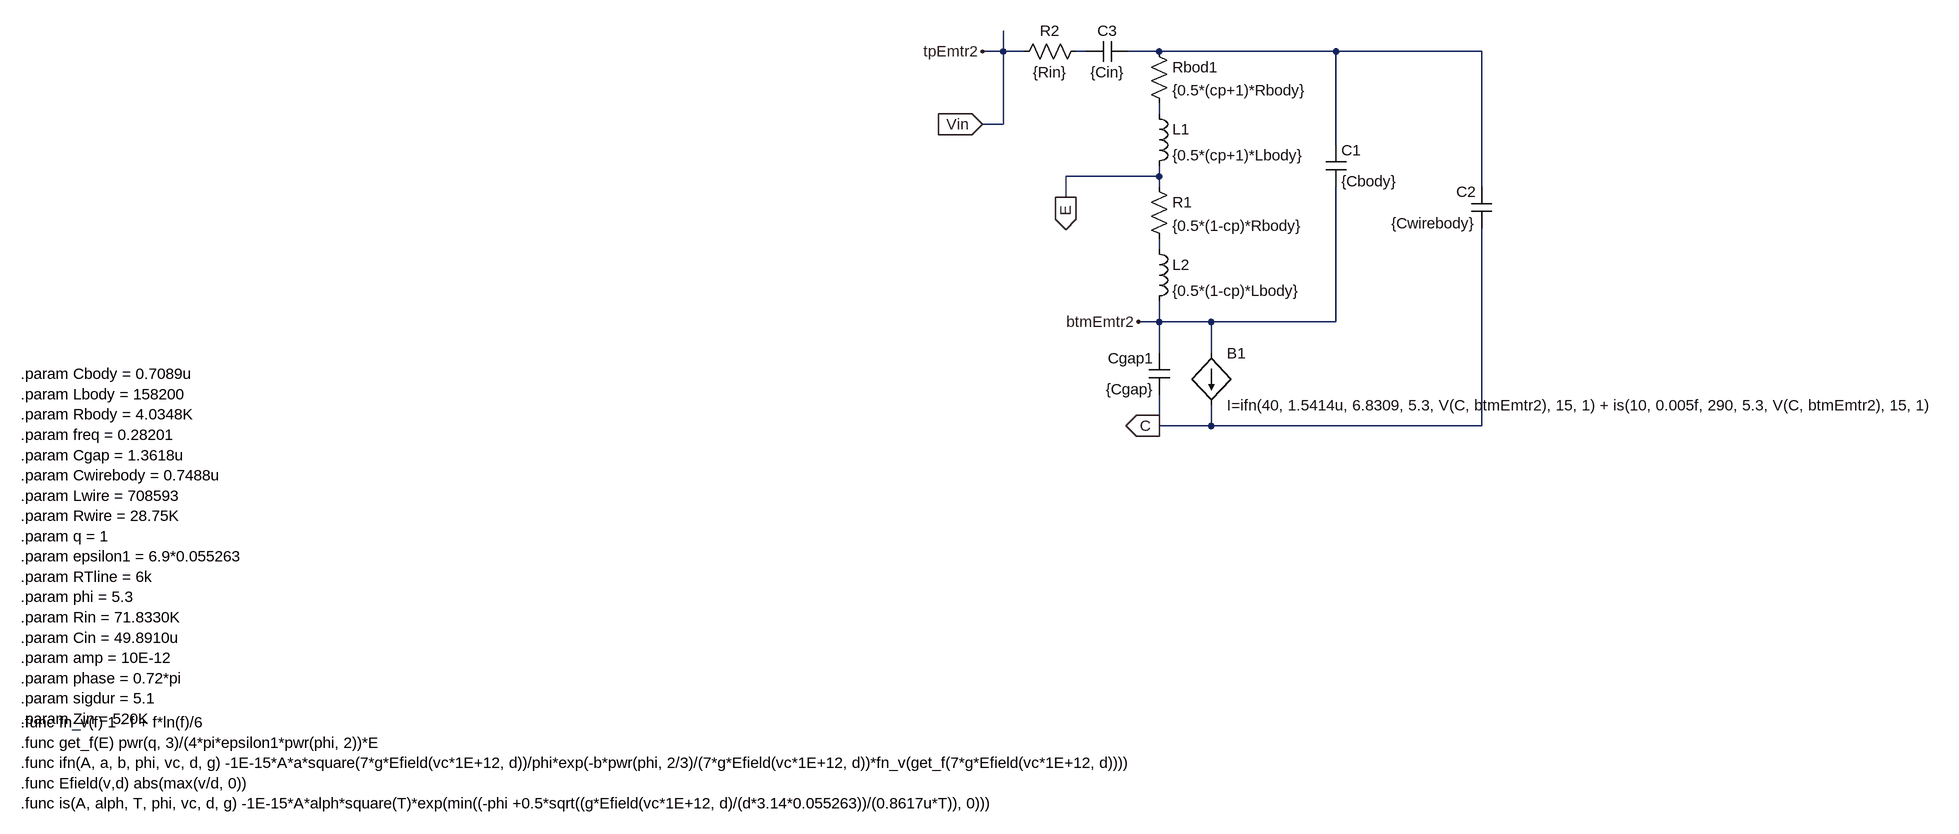
[diagram p0: schematic nanoantenna_component.asc]
nanoantenna_component.asc, the LTspice schematic file:
Version 4.1
SHEET 1 3116 680
WIRE 1440 -1344 1440 -1376
WIRE 1440 -1344 1408 -1344
WIRE 1472 -1344 1440 -1344
WIRE 1568 -1344 1552 -1344
WIRE 1680 -1344 1632 -1344
WIRE 1952 -1344 1680 -1344
WIRE 2176 -1344 1952 -1344
WIRE 1680 -1248 1680 -1264
WIRE 1440 -1232 1440 -1344
WIRE 1440 -1232 1408 -1232
WIRE 1952 -1200 1952 -1344
WIRE 1680 -1152 1680 -1168
WIRE 1680 -1152 1536 -1152
WIRE 1680 -1136 1680 -1152
WIRE 2176 -1136 2176 -1344
WIRE 1536 -1120 1536 -1152
WIRE 1680 -1040 1680 -1056
WIRE 1680 -928 1680 -960
WIRE 1680 -928 1648 -928
WIRE 1760 -928 1680 -928
WIRE 1952 -928 1952 -1136
WIRE 1952 -928 1760 -928
WIRE 1680 -880 1680 -928
WIRE 1760 -880 1760 -928
WIRE 1680 -768 1680 -816
WIRE 1760 -768 1760 -800
WIRE 1760 -768 1680 -768
WIRE 2176 -768 2176 -1072
WIRE 2176 -768 1760 -768
FLAG 1408 -1232 Vin
IOPIN 1408 -1232 In
FLAG 1536 -1120 E
IOPIN 1536 -1120 Out
FLAG 1680 -768 C
IOPIN 1680 -768 Out
FLAG 1648 -928 btmEmtr2
FLAG 1408 -1344 tpEmtr2
SYMBOL bi 1760 -880 R0
SYMATTR InstName B1
SYMATTR Value I=ifn(40, 1.5414u, 6.8309, 5.3, V(C, btmEmtr2), 15, 1) + is(10, 0.005f, 290, 5.3, V(C, btmEmtr2), 15, 1)
SYMBOL cap 1936 -1200 R0
SYMATTR InstName C1
SYMATTR Value {Cbody}
SYMBOL cap 1696 -816 R180
WINDOW 0 24 56 Left 2
WINDOW 3 24 8 Left 2
SYMATTR InstName Cgap1
SYMATTR Value {Cgap}
SYMBOL cap 2192 -1072 R180
WINDOW 0 24 56 Left 2
WINDOW 3 24 8 Left 2
SYMATTR InstName C2
SYMATTR Value {Cwirebody}
SYMBOL res 1664 -1360 R0
SYMATTR InstName Rbod1
SYMATTR Value {0.5*(cp+1)*Rbody}
SYMBOL res 1664 -1152 R0
SYMATTR InstName R1
SYMATTR Value {0.5*(1-cp)*Rbody}
SYMBOL ind 1664 -1264 R0
SYMATTR InstName L1
SYMATTR Value {0.5*(cp+1)*Lbody}
SYMBOL ind 1664 -1056 R0
SYMATTR InstName L2
SYMATTR Value {0.5*(1-cp)*Lbody}
SYMBOL res 1568 -1360 R90
WINDOW 0 0 56 VBottom 2
WINDOW 3 32 56 VTop 2
SYMATTR InstName R2
SYMATTR Value {Rin}
SYMBOL cap 1632 -1360 R90
WINDOW 0 0 32 VBottom 2
WINDOW 3 32 32 VTop 2
SYMATTR InstName C3
SYMATTR Value {Cin}
TEXT -72 -848 Left 2 !.param Cbody = 0.7089u\n.param Lbody = 158200\n.param Rbody = 4.0348K\n.param freq = 0.28201\n.param Cgap = 1.3618u\n.param Cwirebody = 0.7488u\n.param Lwire = 708593\n.param Rwire = 28.75K\n.param q = 1\n.param epsilon1 = 6.9*0.055263\n.param RTline = 6k\n.param phi = 5.3\n.param Rin = 71.8330K\n.param Cin = 49.8910u\n.param amp = 10E-12\n.param phase = 0.72*pi\n.param sigdur = 5.1\n.param Zin = 520K
TEXT -72 -312 Left 2 !.func fn_v(f) 1 - f + f*ln(f)/6\n.func get_f(E) pwr(q, 3)/(4*pi*epsilon1*pwr(phi, 2))*E\n.func ifn(A, a, b, phi, vc, d, g) -1E-15*A*a*square(7*g*Efield(vc*1E+12, d))/phi*exp(-b*pwr(phi, 2/3)/(7*g*Efield(vc*1E+12, d))*fn_v(get_f(7*g*Efield(vc*1E+12, d))))\n.func Efield(v,d) abs(max(v/d, 0))\n.func is(A, alph, T, phi, vc, d, g) -1E-15*A*alph*square(T)*exp(min((-phi +0.5*sqrt((g*Efield(vc*1E+12, d)/(d*3.14*0.055263))/(0.8617u*T)), 0)))

The netlist it stands for:
* nanoantenna_component.asc
B1 btmEmtr2 C I=ifn(40, 1.5414u, 6.8309, 5.3, V(C, btmEmtr2), 15, 1) + is(10, 0.005f, 290, 5.3, V(C, btmEmtr2), 15, 1)
C1 N002 btmEmtr2 {Cbody}
Cgap1 C btmEmtr2 {Cgap}
C2 C N002 {Cwirebody}
Rbod1 N002 N003 {0.5*(cp+1)*Rbody}
R1 E N004 {0.5*(1-cp)*Rbody}
L1 N003 E {0.5*(cp+1)*Lbody}
L2 N004 btmEmtr2 {0.5*(1-cp)*Lbody}
R2 N001 tpEmtr2 {Rin}
C3 N002 N001 {Cin}
.param Cbody = 0.7089u
.param Lbody = 158200
.param Rbody = 4.0348K
.param freq = 0.28201
.param Cgap = 1.3618u
.param Cwirebody = 0.7488u
.param Lwire = 708593
.param Rwire = 28.75K
.param q = 1
.param epsilon1 = 6.9*0.055263
.param RTline = 6k
.param phi = 5.3
.param Rin = 71.8330K
.param Cin = 49.8910u
.param amp = 10E-12
.param phase = 0.72*pi
.param sigdur = 5.1
.param Zin = 520K
.func fn_v(f) 1 - f + f*ln(f)/6
.func get_f(E) pwr(q, 3)/(4*pi*epsilon1*pwr(phi, 2))*E
.func ifn(A, a, b, phi, vc, d, g) -1E-15*A*a*square(7*g*Efield(vc*1E+12, d))/phi*exp(-b*pwr(phi, 2/3)/(7*g*Efield(vc*1E+12, d))*fn_v(get_f(7*g*Efield(vc*1E+12, d))))
.func Efield(v,d) abs(max(v/d, 0))
.func is(A, alph, T, phi, vc, d, g) -1E-15*A*alph*square(T)*exp(min((-phi +0.5*sqrt((g*Efield(vc*1E+12, d)/(d*3.14*0.055263))/(0.8617u*T)), 0)))
.backanno
.end